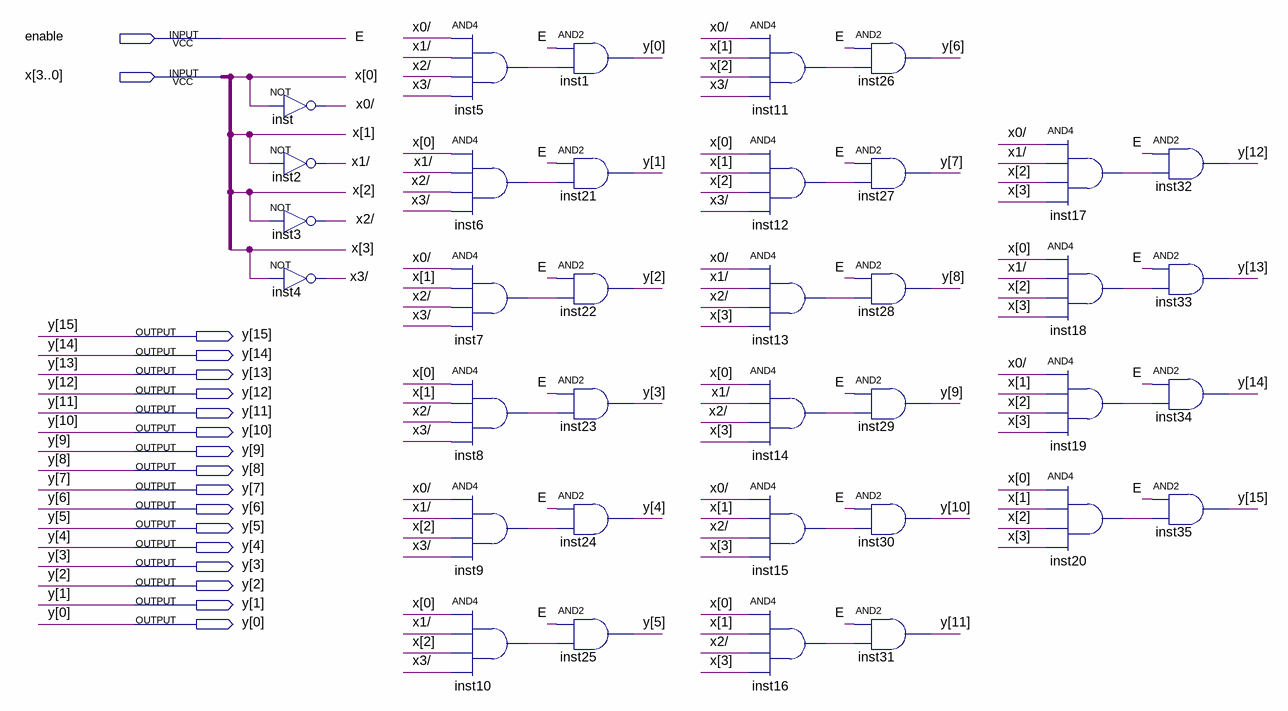
[diagram p0: schematic sheet]
// Quartus schematic decoderBIN_ONEH.bdf as structural Verilog: 36 symbols, 18 pins
module decoderBIN_ONEH (
  input  enable,
  input  [3:0] x,
  output [15:0] y
);

  wire inst5_out, inst6_out, inst7_out, inst8_out, inst9_out, inst10_out, inst11_out, inst12_out, inst13_out,
       inst14_out, inst15_out, inst16_out, inst17_out, inst18_out, inst19_out, inst20_out, \x0/ , \x1/ ,
       \x2/ , \x3/ ;

  not inst (\x0/ , x[0]);
  not inst2 (\x1/ , x[1]);
  not inst3 (\x2/ , x[2]);
  not inst4 (\x3/ , x[3]);
  and inst5 (inst5_out, \x0/ , \x1/ , \x2/ , \x3/ );
  and inst6 (inst6_out, x[0], \x1/ , \x2/ , \x3/ );
  and inst7 (inst7_out, \x0/ , x[1], \x2/ , \x3/ );
  and inst8 (inst8_out, x[0], x[1], \x2/ , \x3/ );
  and inst9 (inst9_out, \x0/ , \x1/ , x[2], \x3/ );
  and inst10 (inst10_out, x[0], \x1/ , x[2], \x3/ );
  and inst1 (y[0], enable, inst5_out);
  and inst21 (y[1], enable, inst6_out);
  and inst22 (y[2], enable, inst7_out);
  and inst23 (y[3], enable, inst8_out);
  and inst24 (y[4], enable, inst9_out);
  and inst25 (y[5], enable, inst10_out);
  and inst11 (inst11_out, \x0/ , x[1], x[2], \x3/ );
  and inst12 (inst12_out, x[0], x[1], x[2], \x3/ );
  and inst13 (inst13_out, \x0/ , \x1/ , \x2/ , x[3]);
  and inst14 (inst14_out, x[0], \x1/ , \x2/ , x[3]);
  and inst15 (inst15_out, \x0/ , x[1], \x2/ , x[3]);
  and inst16 (inst16_out, x[0], x[1], \x2/ , x[3]);
  and inst26 (y[6], enable, inst11_out);
  and inst27 (y[7], enable, inst12_out);
  and inst28 (y[8], enable, inst13_out);
  and inst29 (y[9], enable, inst14_out);
  and inst30 (y[10], enable, inst15_out);
  and inst31 (y[11], enable, inst16_out);
  and inst17 (inst17_out, \x0/ , \x1/ , x[2], x[3]);
  and inst18 (inst18_out, x[0], \x1/ , x[2], x[3]);
  and inst19 (inst19_out, \x0/ , x[1], x[2], x[3]);
  and inst20 (inst20_out, x[0], x[1], x[2], x[3]);
  and inst32 (y[12], enable, inst17_out);
  and inst33 (y[13], enable, inst18_out);
  and inst34 (y[14], enable, inst19_out);
  and inst35 (y[15], enable, inst20_out);

  // Other names for the same wires on the sheet: E = enable
endmodule
